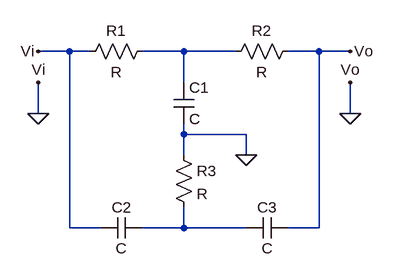
[diagram p0: schematic Draft1.asc]
Draft1.asc, the LTspice schematic file:
Version 4
SHEET 1 880 680
WIRE 0 112 -48 112
WIRE 32 112 0 112
WIRE 176 112 112 112
WIRE 256 112 176 112
WIRE 384 112 336 112
WIRE 432 112 384 112
WIRE 176 160 176 112
WIRE -48 208 -48 160
WIRE 432 208 432 160
WIRE 176 240 176 224
WIRE 272 240 176 240
WIRE 176 272 176 240
WIRE 272 272 272 240
WIRE 0 384 0 112
WIRE 48 384 0 384
WIRE 176 384 176 352
WIRE 176 384 112 384
WIRE 272 384 176 384
WIRE 384 384 384 112
WIRE 384 384 336 384
FLAG -48 208 0
FLAG 272 272 0
FLAG 432 208 0
FLAG -48 112 Vi
FLAG -48 160 Vi
FLAG 432 112 Vo
FLAG 432 160 Vo
SYMBOL res 128 96 R90
WINDOW 0 0 56 VBottom 2
WINDOW 3 32 56 VTop 2
SYMATTR InstName R1
SYMBOL res 352 96 R90
WINDOW 0 0 56 VBottom 2
WINDOW 3 32 56 VTop 2
SYMATTR InstName R2
SYMBOL cap 160 160 R0
SYMATTR InstName C1
SYMBOL res 160 256 R0
SYMATTR InstName R3
SYMBOL cap 112 368 R90
WINDOW 0 0 32 VBottom 2
WINDOW 3 32 32 VTop 2
SYMATTR InstName C2
SYMBOL cap 336 368 R90
WINDOW 0 0 32 VBottom 2
WINDOW 3 32 32 VTop 2
SYMATTR InstName C3

The netlist it stands for:
* Draft1.asc
R1 N001 0 R
R2 0 N001 R
C1 N001 0 C
R3 0 N002 R
C2 N002 0 C
C3 0 N002 C
.backanno
.end